# EAGLE design BusPirate-v4c-ll (EAGLE 5.11)
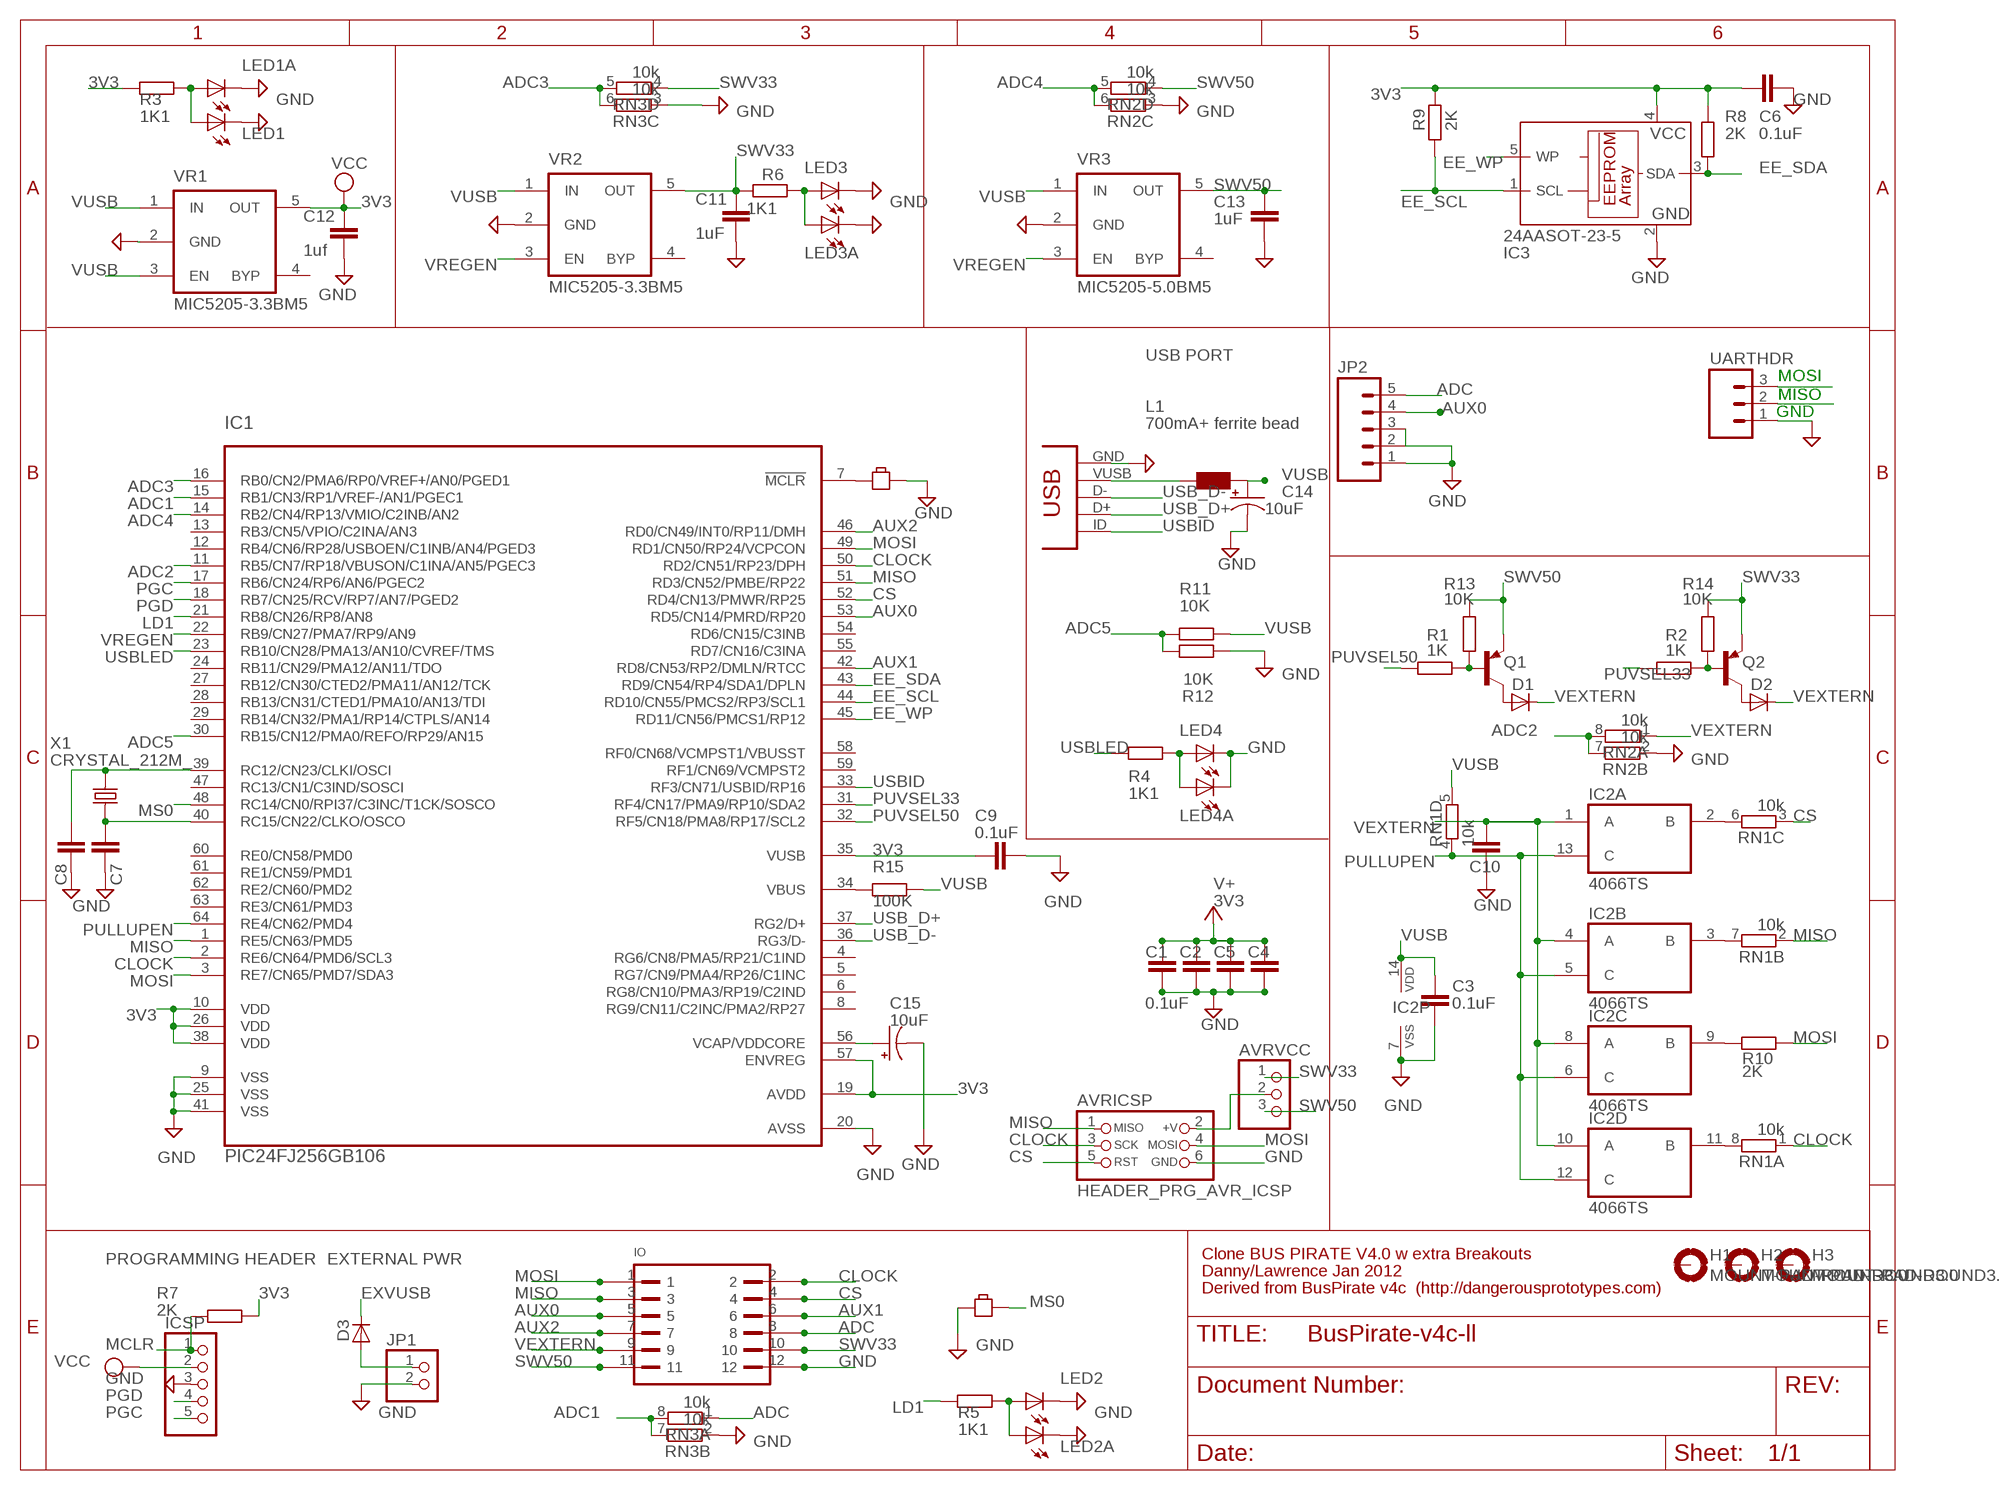
[diagram p0: schematic, sheet 1]

## Parts
AVRICSP  HEADER_PRG_AVR_ICSP  [HEADER_PRG_2X03]
AVRVCC  PINHD-1X3  [1X03]
C1  0.1uF  C-EUC0603  [C0603]
C2  0.1uF  C-EUC0603  [C0603]
C3  0.1uF  C-EUC0603  [C0603]
C4  0.1uF  C-EUC0603  [C0603]
C5  0.1uF  C-EUC0603  [C0603]
C6  0.1uF  C-EUC0603  [C0603]
C7  0.1uF  C-EUC0603  [C0603]
C8  0.1uF  C-EUC0603  [C0603]
C9  0.1uF  C-EUC0603  [C0603]
C10  0.1uF  C-EUC0603  [C0603]
C11  1uF  C-EUC0603  [C0603]
C12  1uf  C-EUC0603  [C0603]
C13  1uF  C-EUC0603  [C0603]
C14  10uF  CPOL-USA/3216-18R  [A/3216-18R]
C15  10uF  CPOL-USA/3216-18R  [A/3216-18R]
D1  MBR0520LT  [SOD123]
D2  MBR0520LT  [SOD123]
D3  MBR0520LT  [SOD123]
H1  MOUNT-PAD-ROUND3.0  [3,0-PAD]
H2  MOUNT-PAD-ROUND3.0  [3,0-PAD]
H3  MOUNT-PAD-ROUND3.0  [3,0-PAD]
IC1  PIC24FJ256GB106  [TQFP64-10X10]
IC2  4066TS  [40XX_TSSOP14]
IC3  24AASOT-23-5  24AA  [SOT-23-5]
ICSP  PINHD-1X5  [1X05]
IO  PINSHRD-PTH-2X06  [PINSHRD_PTH_2X06]
JP1  PINHD-1X02_2.54-S  [1X02-S]
JP2  M05PTH  [1X05]
L1  700mA+ ferrite bead  WE-KIL_0805  [WE-KI_0805_B]
LED1  LEDCHIP-LED0805  [CHIP-LED0805]
LED1A  LEDCHIP-LED0805  [CHIP-LED0805]
LED2  LEDCHIP-LED0805  [CHIP-LED0805]
LED2A  LEDCHIP-LED0805  [CHIP-LED0805]
LED3  LEDCHIP-LED0805  [CHIP-LED0805]
LED3A  LEDCHIP-LED0805  [CHIP-LED0805]
LED4  LEDCHIP-LED0805  [CHIP-LED0805]
LED4A  LEDCHIP-LED0805  [CHIP-LED0805]
NORMAL  BUTTON-SMD-2P  [BUTTON_2P_SMD]
Q1  MMBTA56-SOT23  [SOT23]
Q2  MMBTA56-SOT23  [SOT23]
R1  1K  R-EU_R0603  [R0603]
R2  1K  R-EU_R0603  [R0603]
R3  1K1  R-EU_R0603  [R0603]
R4  1K1  R-EU_R0603  [R0603]
R5  1K1  R-EU_R0603  [R0603]
R6  1K1  R-EU_R0603  [R0603]
R7  2K  R-EU_R0603  [R0603]
R8  2K  R-EU_R0603  [R0603]
R9  2K  R-EU_R0603  [R0603]
R10  2K  R-EU_R0603  [R0603]
R11  10K  R-EU_R0603  [R0603]
R12  10K  R-EU_R0603  [R0603]
R13  10K  R-EU_R0603  [R0603]
R14  10K  R-EU_R0603  [R0603]
R15  100K  R-EU_R0603  [R0603]
RESET  BUTTON-SMD-2P  [BUTTON_2P_SMD]
RN1  10k  RNETWORK  [RN8P-4R-CRA06S]
RN2  10k  RNETWORK  [RN8P-4R-CRA06S]
RN3  10k  RNETWORK  [RN8P-4R-CRA06S]
UARTHDR  M03LOCK  [1X03_LOCK]
USB  USB mini-b  CON-USB-MINI-BUSB1  [CONN_USB_MINI-B]
VR1  MIC5205-3.3BM5  MIC5205  [SOT-23-5]
VR2  MIC5205-3.3BM5  MIC5205  [SOT-23-5]
VR3  MIC5205-5.0BM5  MIC5205  [SOT-23-5]
X1  CRYSTAL_212M_  [4X6]

## Nets
3V3: C1.1 C2.1 C4.1 C5.1 C6.1 C9.1 C12.1 IC1.10(VDD) IC1.19(AVDD) IC1.26(VDD) IC1.35(VUSB) IC1.38(VDD) IC1.57(ENVREG) IC3.4(VCC) ICSP.2 R3.2 R7.2 R8.2 R9.2 VR1.5(OUT) ; supply symbol labelled VCC, V+
ADC: IO.8 JP2.5 RN3.1
ADC1: IC1.15(RB1/CN3/RP1/VREF-/AN1/PGEC1) RN3.7 RN3.8
ADC2: IC1.11(RB5/CN7/RP18/VBUSON/C1INA/AN5/PGEC3) RN2.7 RN2.8
ADC3: IC1.16(RB0/CN2/PMA6/RP0/VREF+/AN0/PGED1) RN3.5 RN3.6
ADC4: IC1.14(RB2/CN4/RP13/VMIO/C2INB/AN2) RN2.5 RN2.6
ADC5: IC1.30(RB15/CN12/PMA0/REFO/RP29/AN15) R11.2 R12.2
AUX0: IC1.53(RD5/CN14/PMRD/RP20) IO.5 JP2.4
AUX1: IC1.42(RD8/CN53/RP2/DMLN/RTCC) IO.6
AUX2: IC1.46(RD0/CN49/INT0/RP11/DMH) IO.7
CLOCK: AVRICSP.3(SCK) IC1.2(RE6/CN64/PMD6/SCL3) IC1.50(RD2/CN51/RP23/DPH) IO.2 RN1.1
CS: AVRICSP.5(RST) IC1.52(RD4/CN13/PMWR/RP25) IO.4 RN1.3
EE_SCL: IC1.44(RD10/CN55/PMCS2/RP3/SCL1) IC3.1(SCL) R9.1
EE_SDA: IC1.43(RD9/CN54/RP4/SDA1/DPLN) IC3.3(SDA) R8.1
EE_WP: IC1.45(RD11/CN56/PMCS1/RP12) IC3.5(WP)
EXVUSB: D3.C L1.2 USB.VUSB
GND: AVRICSP.6(GND) C1.2 C2.2 C3.2 C4.2 C5.2 C6.2 C7.2 C8.2 C9.2 C10.2 C11.2 C12.2 C13.2 C14.- C15.- IC1.9(VSS) IC1.20(AVSS) IC1.25(VSS) IC1.41(VSS) IC2.7(P:VSS) IC3.2(GND) ICSP.3 IO.12 JP1.2 JP2.1 JP2.2 JP2.3 LED1.C LED1A.C LED2.C LED2A.C LED3.C LED3A.C LED4.C LED4A.C NORMAL.1 R12.1 RESET.P$2 RN2.2 RN2.3 RN3.2 RN3.3 UARTHDR.1 USB.GND VR1.2(GND) VR2.2(GND) VR3.2(GND)
LD1: IC1.21(RB8/CN26/RP8/AN8) R5.2
MCLR: IC1.7(!MCLR) ICSP.1 R7.1 RESET.1
MISO: AVRICSP.1(MISO) IC1.1(RE5/CN63/PMD5) IC1.51(RD3/CN52/PMBE/RP22) IO.3 RN1.2 UARTHDR.2
MOSI: AVRICSP.4(MOSI) IC1.3(RE7/CN65/PMD7/SDA3) IC1.49(RD1/CN50/RP24/VCPCON) IO.1 R10.1 UARTHDR.3
MS0: IC1.48(RC14/CN0/RPI37/C3INC/T1CK/SOSCO) NORMAL.P$2
N$1: IC2.9(C:B) R10.2
N$2: IC2.11(D:B) RN1.8
N$3: D1.A Q1.3(C)
N$4: IC2.2(A:B) RN1.6
N$5: IC2.3(B:B) RN1.7
N$6: LED2.A LED2A.A R5.1
N$7: LED1.A LED1A.A R3.1
N$8: Q2.1(B) R2.1 R14.2
N$9: C7.1 IC1.40(RC15/CN22/CLKO/OSCO) X1.2(X2)
N$10: C15.+ IC1.56(VCAP/VDDCORE)
N$11: IC1.34(VBUS) R15.2
N$12: C8.1 IC1.39(RC12/CN23/CLKI/OSCI) X1.1(X1)
N$13: LED4.A LED4A.A R4.1
N$14: D2.A Q2.3(C)
N$15: D3.A JP1.1
N$16: AVRICSP.2(+V) AVRVCC.2
N$17: Q1.1(B) R1.1 R13.2
N$18: LED3.A LED3A.A R6.1
PGC: IC1.17(RB6/CN24/RP6/AN6/PGEC2) ICSP.5
PGD: IC1.18(RB7/CN25/RCV/RP7/AN7/PGED2) ICSP.4
PULLUPEN: IC1.64(RE4/CN62/PMD4) IC2.5(B:C) IC2.6(C:C) IC2.12(D:C) IC2.13(A:C) RN1.4
PUVSEL33: IC1.31(RF4/CN17/PMA9/RP10/SDA2) R2.2
PUVSEL50: IC1.32(RF5/CN18/PMA8/RP17/SCL2) R1.2
SWV33: AVRVCC.1 C11.1 IO.10 Q2.2(E) R6.2 R14.1 RN3.4 VR2.5(OUT)
SWV50: AVRVCC.3 C13.1 IO.11 Q1.2(E) R13.1 RN2.4 VR3.5(OUT)
USB_D+: IC1.37(RG2/D+) USB.D+
USB_D-: IC1.36(RG3/D-) USB.D-
USBID: IC1.33(RF3/CN71/USBID/RP16) USB.ID(USBID)
USBLED: IC1.23(RB10/CN28/PMA13/AN10/CVREF/TMS) R4.2
VEXTERN: C10.1 D1.C D2.C IC2.1(A:A) IC2.4(B:A) IC2.8(C:A) IC2.10(D:A) IO.9 RN2.1
VREGEN: IC1.22(RB9/CN27/PMA7/RP9/AN9) VR2.3(EN) VR3.3(EN)
VUSB: C3.1 C14.+ IC2.14(P:VDD) L1.1 R11.1 R15.1 RN1.5 VR1.1(IN) VR1.3(EN) VR2.1(IN) VR3.1(IN)
Unconnected: H1.B3,0(MOUNT) H2.B3,0(MOUNT) H3.B3,0(MOUNT) IC1.4(RG6/CN8/PMA5/RP21/C1IND) IC1.5(RG7/CN9/PMA4/RP26/C1INC) IC1.6(RG8/CN10/PMA3/RP19/C2IND) IC1.8(RG9/CN11/C2INC/PMA2/RP27) IC1.12(RB4/CN6/RP28/USBOEN/C1INB/AN4/PGED3) IC1.13(RB3/CN5/VPIO/C2INA/AN3) IC1.24(RB11/CN29/PMA12/AN11/TDO) IC1.27(RB12/CN30/CTED2/PMA11/AN12/TCK) IC1.28(RB13/CN31/CTED1/PMA10/AN13/TDI) IC1.29(RB14/CN32/PMA1/RP14/CTPLS/AN14) IC1.47(RC13/CN1/C3IND/SOSCI) IC1.54(RD6/CN15/C3INB) IC1.55(RD7/CN16/C3INA) IC1.58(RF0/CN68/VCMPST1/VBUSST) IC1.59(RF1/CN69/VCMPST2) IC1.60(RE0/CN58/PMD0) IC1.61(RE1/CN59/PMD1) IC1.62(RE2/CN60/PMD2) IC1.63(RE3/CN61/PMD3) USB.BODY@1(BODY) USB.BODY@2(BODY) USB.BODY@3(BODY) USB.BODY@4(BODY) VR1.4(BYP) VR2.4(BYP) VR3.4(BYP)

## Notes on the sheet
- USB PORT
- MOSI
- MISO
- GND
- Clone BUS PIRATE V4.0 w extra Breakouts
- PROGRAMMING HEADER | EXTERNAL PWR
- Danny/Lawrence Jan 2012
- Derived from BusPirate v4c  (http://dangerousprototypes.com)

## Library data of the parts
AVRICSP = dp_devices:HEADER_PRG_AVR_ICSP: 2x3 AVR ICSP programming header
AVRVCC = adafruit:PINHD-1X3: PIN HEADER
C1-C13 = rcl:C-EU: CAPACITOR, European symbol
C14 C15 = LL:CPOL-US: POLARIZED CAPACITOR, American symbol Footprints somewhat modified from Adafruits (1206)
D1-D3 = diode:MBR0520LT: SCHOTTKY BARRIER RECTIFIER Source: http://onsemi.com .. MBR0520LT1-D.pdf
H1-H3 = holes:MOUNT-PAD-ROUND: MOUNTING PAD, round
IC1 = LL:PIC24FJ256GB106: 16-Bit Flash Microcontroller with USB On-The-Go(OTG)
IC2 = 40xx:4066: Quad bilateral ANALOG SWITCH
IC3 = dp_devices:24AA*; 24AA: 24AA
ICSP = pinhead:PINHD-1X5: PIN HEADER
IO = dp_devices:PINSHRD-PTH-2X06: Shrouded pin header, 2.54mm pitch
JP1 = pinhead-2:PINHD-1X02: PIN HEADER
JP2 = SparkFun - Copy:M05: Header 5 Standard 5-pin 0.1" header. Use with straight break away headers (SKU : PRT-00116), right angle break away headers (PRT-00553), swiss pins (PRT-00743), machine pins (PRT-00117), and female headers (PRT-00115). Molex polarized connector foot print use with SKU : PRT-08230 with associated crimp pins and housings.
L1 = wuerth-elektronik:WE-KIL: SMD Wire Wound Ceramic Inductor WE-KIL - Low profile - High Q values -- Bluetooth -- Wireless LAN -- RF oscillation circuit -- IF impedance matching
LED1 LED1A LED2 LED2A LED3 LED3A LED4 LED4A = led:LED: LED OSRAM: - CHIPLED LG R971, LG N971, LY N971, LG Q971, LY Q971, LO R971, LY R971 LH N974, LH R974 LS Q976, LO Q976, LY Q976 LO Q996 - Hyper CHIPLED LW Q18S LB Q993, LB Q99A, LB R99A - SideLED LS A670, LO A670, LY A670, LG A670, LP A670 LB A673, LV A673, LT A673, LW A673 LH A674 LY A675 LS A676, LA A676, LO A676, LY A676, LW A676 LS A679, LY A679, LG A679 - Hyper Micro SIDELED® LS Y876, LA Y876, LO Y876, LY Y876 LT Y87S - SmartLED LW L88C, LW L88S LB L89C, LB L89S, LG L890 LS L89K, LO L89K, LY L89K LS L896, LA L896, LO L896, LY L896 - TOPLED LS T670, LO T670, LY T670, LG T670, LP T670 LSG T670, LSP T670, LSY T670, LOP T670, LYG T670 LG T671, LOG T671, LSG T671 LB T673, LV T673, LT T673, LW T673 LH T674 LS T676, LA T676, LO T676, LY T676, LB T676, LH T676, LSB T676, LW T676 LB T67C, LV T67C, LT T67C, LS T67K, LO T67K, LY T67K, LW E67C LS E67B, LA E67B, LO E67B, LY E67B, LB E67C, LV E67C, LT E67C LW T67C LS T679, LY T679, LG T679 LS T770, LO T770, LY T770, LG T770, LP T770 LB T773, LV T773, LT T773, LW T773 LH T774 LS E675, LA E675, LY E675, LS T675 LS T776, LA T776, LO T776, LY T776, LB T776 LHGB T686 LT T68C, LB T68C - Hyper Mini TOPLED® LB M676 - Mini TOPLED Santana® LG M470 LS M47K, LO M47K, LY M47K Source: http://www.osram.convergy.de LUXEON: - LUMILED® LXK2-PW12-R00, LXK2-PW12-S00, LXK2-PW14-U00, LXK2-PW14-V00 LXK2-PM12-R00, LXK2-PM12-S00, LXK2-PM14-U00 LXK2-PE12-Q00, LXK2-PE12-R00, LXK2-PE12-S00, LXK2-PE14-T00, LXK2-PE14-U00 LXK2-PB12-K00, LXK2-PB12-L00, LXK2-PB12-M00, LXK2-PB14-N00, LXK2-PB14-P00, LXK2-PB14-Q00 LXK2-PR12-L00, LXK2-PR12-M00, LXK2-PR14-Q00, LXK2-PR14-R00 LXK2-PD12-Q00, LXK2-PD12-R00, LXK2-PD12-S00 LXK2-PH12-R00, LXK2-PH12-S00 LXK2-PL12-P00, LXK2-PL12-Q00, LXK2-PL12-R00 Source: www.luxeon.com KINGBRIGHT: KA-3528ASYC Source: www.kingbright.com
NORMAL RESET = Itead_BP_110825.lbr:BUTTON-SMD-2P: BAS014
Q1 Q2 = transistor-pnp:*-?: PNP Transistor
R1-R3 R5-R10 R13-R15 = rcl:R-EU_: RESISTOR, European symbol
R4 R11 R12 = resistor:R-EU_: RESISTOR, European symbol
RN1-RN3 = dp_devices:RNETWORK: 4 Resistor Array 0603
UARTHDR = SparkFun - Copy:M03: Header 3 Standard 3-pin 0.1" header. Use with straight break away headers (SKU : PRT-00116), right angle break away headers (PRT-00553), swiss pins (PRT-00743), machine pins (PRT-00117), and female headers (PRT-00115). Molex polarized connector foot print use with SKU : PRT-08232 with associated crimp pins and housings.
USB = dp_devices:CON-USB-MINI-B: USB connector
VR1-VR3 = dp_devices:MIC5205: 150ma Low-Noise LDO Regulator
X1 = dp_devices:CRYSTAL_2

## Board
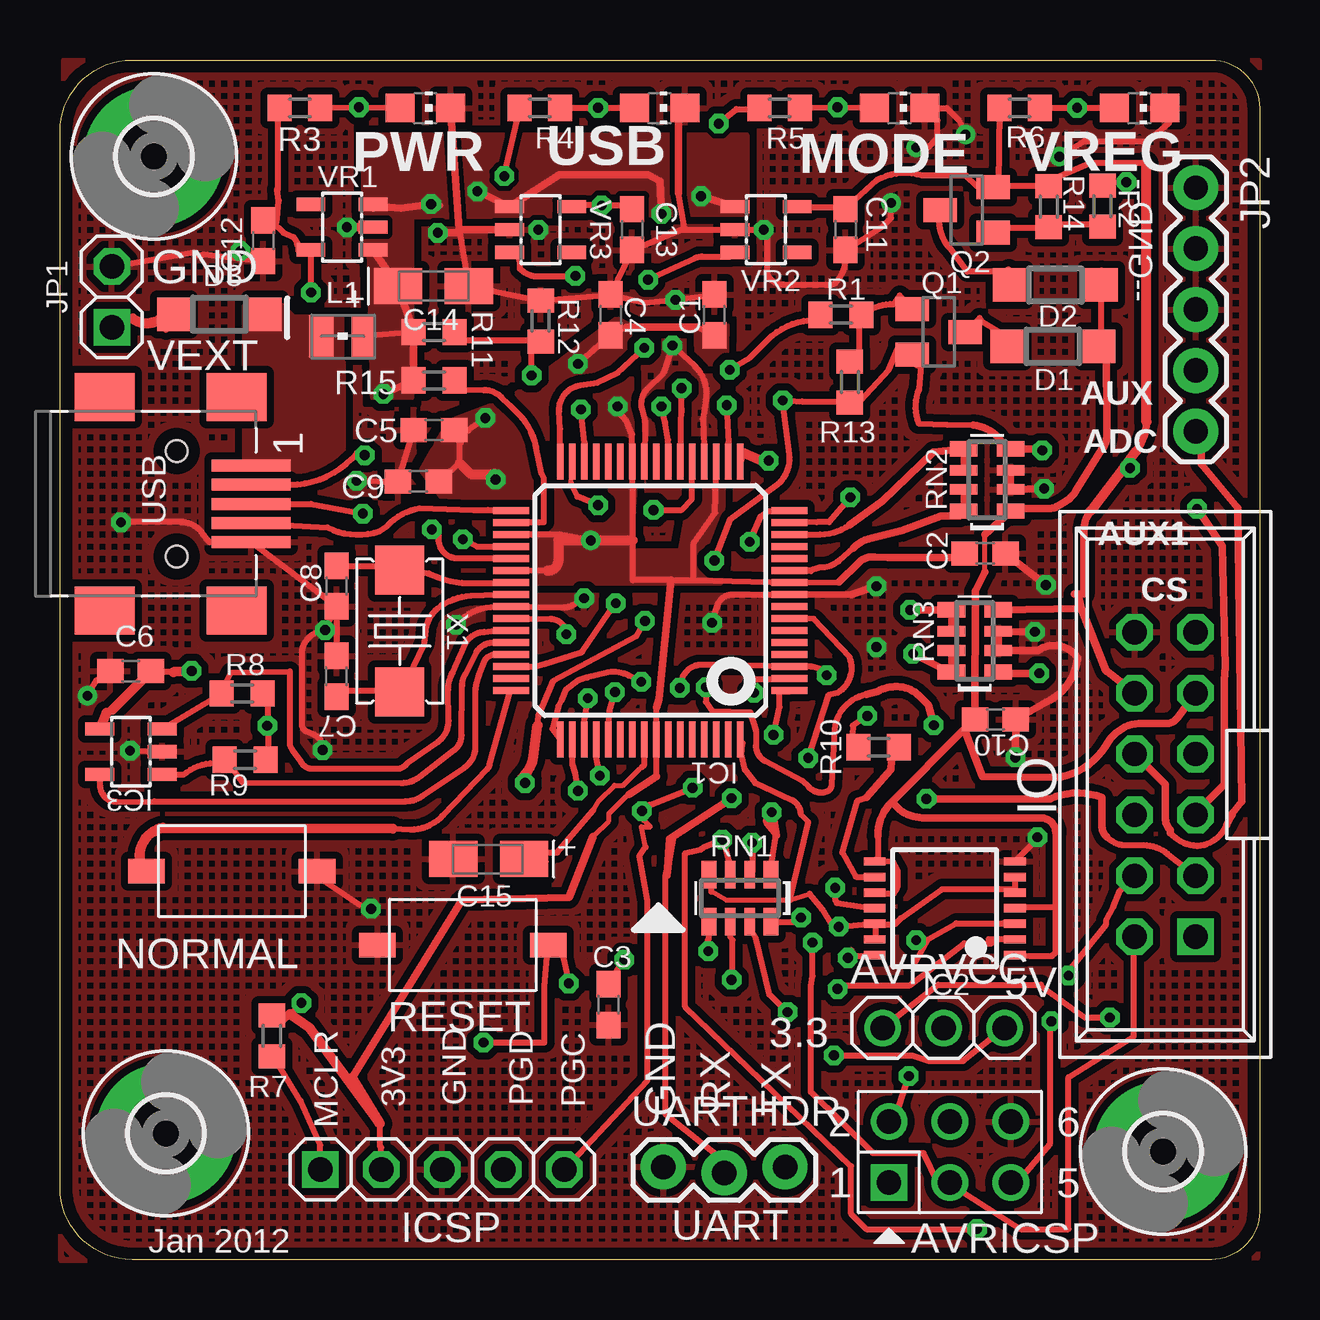
[diagram p1: board, top side]
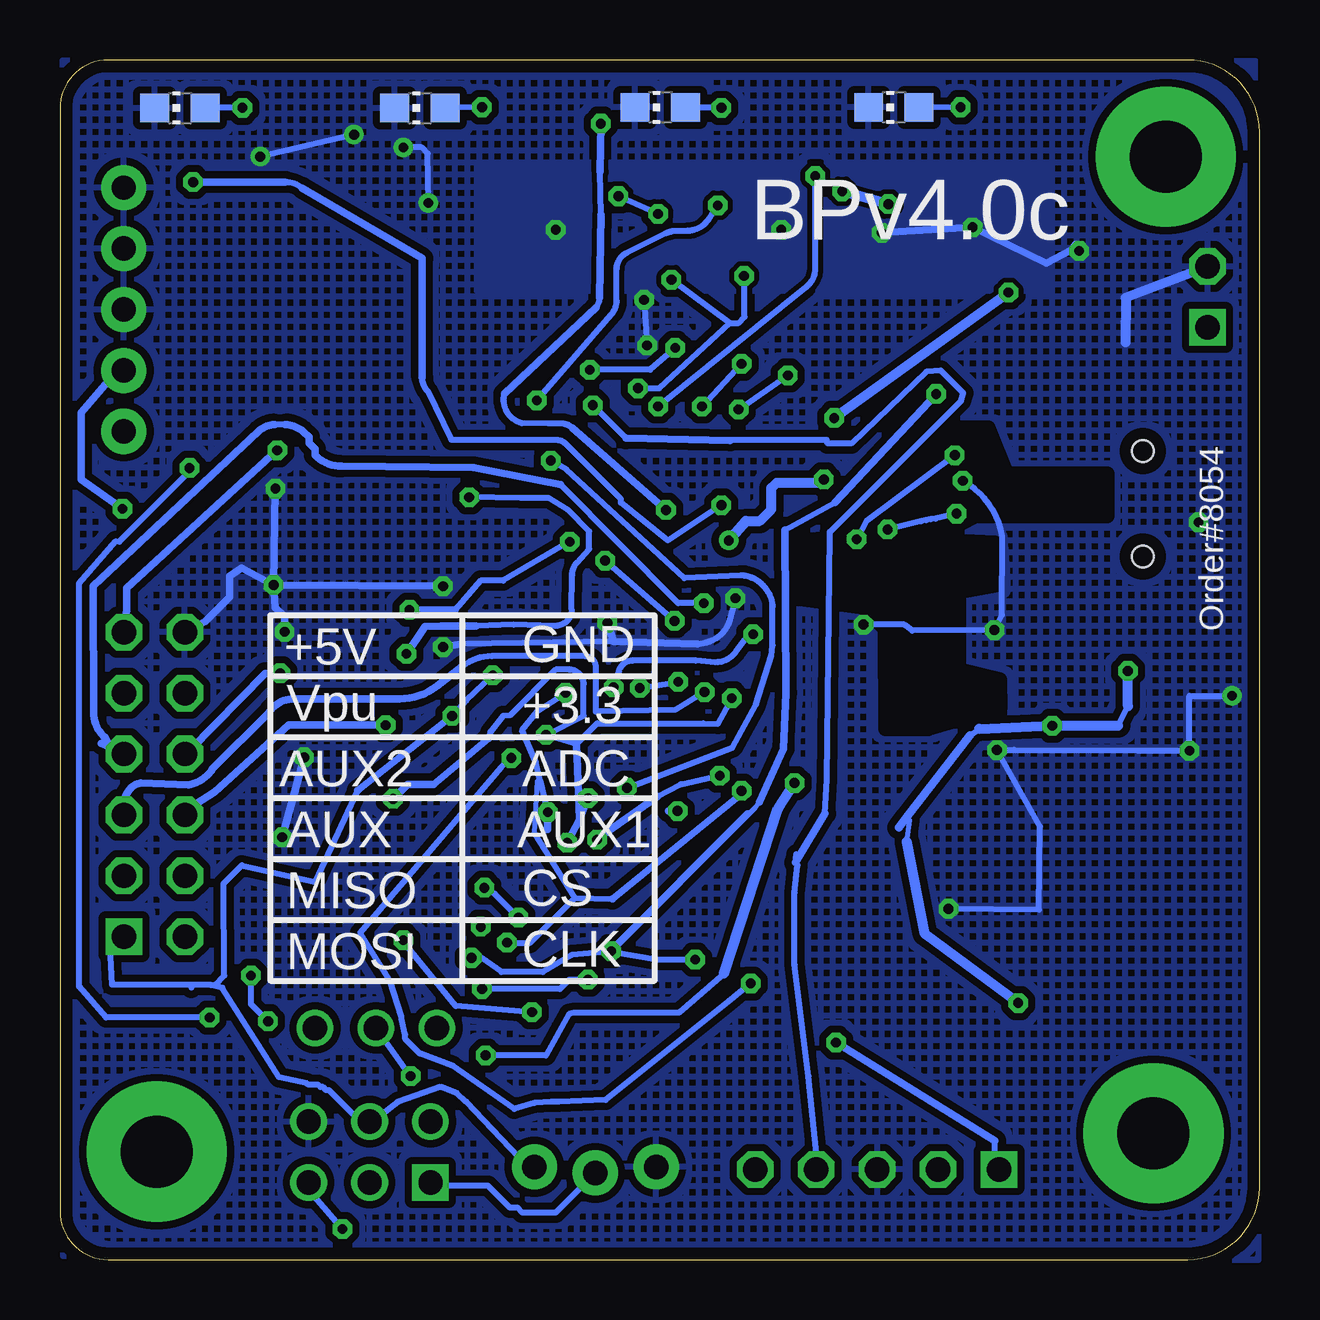
[diagram p2: board, bottom side, seen from below]

Size 50 x 50 mm. Coordinates in mm from the lower left corner, seen from the top.
Outline: 3,50 48,50 arc-90 50,48 50,2 arc-90 48,0 3,0 arc-90 0,3 0,47 arc-90 3,50
Copper layers (1*16): Top 0.0356mm / dielectric 1.5011mm / Bottom 0.0356mm
Design rules "LaenPCBOrder-LL-strict": minimum track width 8mil, minimum drill 16mil, track to track 8mil, track to pad 8mil, pad to pad 12mil, via to via 10mil, smd to smd 4mil, copper to edge 20mil, drill to drill 15mil, minimum pad ring 8mil, minimum via ring 8mil, stop-mask expansion 6mil, vias tented up to drill 25mil, thermal gap 12mil
tKeepout: area 1,43 to 7,49; area 53,43 to 59,49; area 53,14 to 59,20; area 1,14 to 7,20
bKeepout: area -0.2,41.8 to 8.2,50.2; area 51.8,41.8 to 60.2,50.2; area 51.8,12.8 to 60.2,21.2; area -0.2,12.8 to 8.2,21.2
bRestrict: area 10.8,22.1 to 19.3,30.1; area 6.3,28.8 to 19.4,34.7

### Footprints (pad centres in the part's own frame; a part is rotated, then mirrored left to right if it is on the bottom)
HEADER_PRG_2X03 = drill 1.016 square: 1 -2.54,-1.27 | drill 1.016 round: 2 -2.54,1.27; 3 0,-1.27; 4 0,1.27; 5 2.54,-1.27; 6 2.54,1.27
1X03 = drill 1.016 round: 1 -2.54,0; 2 0,0; 3 2.54,0
C0603 = smd 1.1 x 1: 1 -0.85,0; 2 0.85,0
A/3216-18R = smd 2.007 x 1.5: + 1.502,0 | smd 2.025 x 1.5: - -1.451,0
SOD123 = smd 1.4 x 1.4: A 1.9,0; C -1.9,0
3,0-PAD = drill 3 pad 5.842 round: B3,0 0,0
TQFP64-10X10 = smd 1.5 x 0.28: 1 -5.8,3.75; 2 -5.8,3.25; 3 -5.8,2.75; 4 -5.8,2.25; 5 -5.8,1.75; 6 -5.8,1.25; 7 -5.8,0.75; 8 -5.8,0.25; 9 -5.8,-0.25; 10 -5.8,-0.75; 11 -5.8,-1.25; 12 -5.8,-1.75; 13 -5.8,-2.25; 14 -5.8,-2.75; 15 -5.8,-3.25; 16 -5.8,-3.75; 33 5.8,-3.75; 34 5.8,-3.25; 35 5.8,-2.75; 36 5.8,-2.25; 37 5.8,-1.75; 38 5.8,-1.25; 39 5.8,-0.75; 40 5.8,-0.25; 41 5.8,0.25; 42 5.8,0.75; 43 5.8,1.25; 44 5.8,1.75; 45 5.8,2.25; 46 5.8,2.75; 47 5.8,3.25; 48 5.8,3.75 | smd 0.28 x 1.5: 17 -3.75,-5.8; 18 -3.25,-5.8; 19 -2.75,-5.8; 20 -2.25,-5.8; 21 -1.75,-5.8; 22 -1.25,-5.8; 23 -0.75,-5.8; 24 -0.25,-5.8; 25 0.25,-5.8; 26 0.75,-5.8; 27 1.25,-5.8; 28 1.75,-5.8; 29 2.25,-5.8; 30 2.75,-5.8; 31 3.25,-5.8; 32 3.75,-5.8; 49 3.75,5.8; 50 3.25,5.8; 51 2.75,5.8; 52 2.25,5.8; 53 1.75,5.8; 54 1.25,5.8; 55 0.75,5.8; 56 0.25,5.8; 57 -0.25,5.8; 58 -0.75,5.8; 59 -1.25,5.8; 60 -1.75,5.8; 61 -2.25,5.8; 62 -2.75,5.8; 63 -3.25,5.8; 64 -3.75,5.8
40XX_TSSOP14 = smd 0.35 x 0.9: 1 -1.95,-2.925; 2 -1.3,-2.925; 3 -0.65,-2.925; 4 0,-2.925; 5 0.65,-2.925; 6 1.3,-2.925; 7 1.95,-2.925; 8 1.95,2.925; 9 1.3,2.925; 10 0.65,2.925; 11 0,2.925; 12 -0.65,2.925; 13 -1.3,2.925; 14 -1.95,2.925
SOT-23-5 = smd 0.55 x 1.2: 1 -0.95,-1.3; 2 0,-1.3; 3 0.95,-1.3; 4 0.95,1.3; 5 -0.95,1.3
1X05 = drill 1.016 square: 1 -5.08,0 | drill 1.016 octagon: 2 -2.54,0; 3 0,0; 4 2.54,0; 5 5.08,0
PINSHRD_PTH_2X06 = drill 1.016 square: 1 -6.35,-1.27 | drill 1.016 octagon: 2 -6.35,1.27; 3 -3.81,-1.27; 4 -3.81,1.27; 5 -1.27,-1.27; 6 -1.27,1.27; 7 1.27,-1.27; 8 1.27,1.27; 9 3.81,-1.27; 10 3.81,1.27; 11 6.35,-1.27; 12 6.35,1.27
1X02-S = drill 1.016 square: 1 -1.27,0 | drill 1.016 octagon: 2 1.27,0
1X05' = drill 1.016 pad 1.88 round: 1 0,0; 2 2.54,0; 3 5.08,0; 4 7.62,0; 5 10.16,0
WE-KI_0805_B = smd 1.02 x 1.78: 1 -0.89,0; 2 0.89,0
CHIP-LED0805 = smd 1.2 x 1.2: A 0,-1.05; C 0,1.05
BUTTON_2P_SMD = smd 1.524 x 1.016: 1 -3.556,0; P$2 3.556,0
SOT23 = smd 1 x 1.4: 1 -0.95,-1.1; 2 0.95,-1.1; 3 0,1.1
R0603 = smd 1 x 1.1: 1 -0.85,0; 2 0.85,0
RN8P-4R-CRA06S = smd 0.63 x 1.15: 1 -1.295,-0.975; 4 1.295,-0.975; 5 1.295,0.975; 8 -1.295,0.975 | smd 0.44 x 1.15: 2 -0.4,-0.975; 3 0.4,-0.975; 6 0.4,0.975; 7 -0.4,0.975
1X03_LOCK = drill 1.016 pad 1.88 round: 1 0,0.127; 2 2.54,-0.127; 3 5.08,0.127
CONN_USB_MINI-B = smd 2 x 2.5: BODY@1 -4.45,2.5; BODY@2 4.45,2.5; BODY@3 4.45,-3; BODY@4 -4.45,-3 | smd 0.5 x 3.3: D+ 0,3.1; D- -0.8,3.1; GND 1.6,3.1; ID 0.8,3.1; VUSB -1.6,3.1 | hole 0.9: -2.2,0; 2.2,0
4X6@1 = smd 2.032 x 2.032: 1 -2.54,0; 2 2.54,0

### Placement (x,y rotation side)
AVRICSP  37.09,4.48 0 top
AVRVCC  36.83,9.65 0 top
C1  27.27,39.37 90 top
C2  38.56,29.44 0 top
C3  22.86,10.62 270 top
C4  22.96,39.37 90 top
C5  15.59,34.58 180 top
C6  2.95,24.53 180 top
C7  11.53,24.31 90 top
C8  11.53,28.07 270 top
C9  14.94,32.44 180 top
C10  38.99,22.51 0 top
C11  32.73,42.93 270 top
C12  8.47,42.46 270 top
C13  23.84,42.93 270 top
C14  15.59,40.57 180 top
C15  17.84,16.69 0 top
D1  41.39,38.06 180 top
D2  41.49,40.62 180 top
D3  6.65,39.4 180 top
H1  3.91,45.97 0 top
H2  4.42,5.26 0 top
H3  45.97,4.5 0 top
IC1  24.61,27.47 180 top
IC2  36.88,14.64 90 top
IC3  2.96,21.17 90 top
ICSP  15.94,3.75 0 top
IO  46.07,19.8 90 top
JP1  2.16,40.12 90 top
JP2  [1X05']  47.35,44.68 270 top
L1  11.78,38.48 180 top
LED1  15.23,48 270 top
LED1A  15.24,48.02 90 bottom
LED2  35,48 270 top
LED2A  35,48 90 bottom
LED3  45,48 270 top
LED3A  45,48 90 bottom
LED4  25,48 270 top
LED4A  24.98,48.02 90 bottom
NORMAL  7.16,16.19 180 top
Q1  36.62,38.66 270 top
Q2  37.79,43.74 90 top
R1  32.55,39.38 180 top
R2  43.45,43.9 90 top
R3  10,48 180 top
R4  20,48 180 top
R5  30,48 180 top
R6  40,48 180 top
R7  8.84,9.33 90 top
R8  7.59,23.59 0 top
R9  7.72,20.83 0 top
R10  34.12,21.36 0 top
R11  15.59,38.66 0 top
R12  20.04,39.12 270 top
R13  32.92,36.57 90 top
R14  41.21,43.89 270 top
R15  15.59,36.64 0 top
RESET  16.79,13.11 180 top
RN1  28.34,15.06 180 top
RN2  38.64,32.5 90 top
RN3  38.13,25.79 90 top
UARTHDR  25.15,3.73 0 top
USB  4.87,31.5 270 top
VR1  11.75,43.03 90 top
VR2  29.43,42.93 270 top
VR3  20.04,42.93 270 top
X1  CRYSTAL_212M_  [4X6@1]  14.16,26.2 270 top

### Tracks (layer width: path | path; a pad name or v marks a point on that pad's centre or on a via)
3V3  (via drill 0.41)
  Top 0.203: 22.23,17.63 22.89,18.29 22.89,18.59 23.6,19.3 23.72,19.38
  Top 0.254: 9.14,47.95 R3.2 9.09,47.9 9.09,44.6 9.04,44.6 9.12,44.15 9.04,43.36 9.02,43.23 C12.1 9.12,43 9.32,42.8 9.72,42.62 arc-45 9.96,42.01 10.46,42.01 VR1.5 10.46,41.91 v10.46,40.31 | 26.42,28.32 25.48,28.32 23.88,28.32 23.88,29.97 23.88,31.24 IC1.26 23.85,34.39 23.71,34.71 arc41 23.28,35.27 v23.24,35.56 | 26.42,28.32 26.42,29.84 27.3,31.11 IC1.19 | 26.42,28.32 IC1.10 32.46,28.25 | 8.69,22.5 8.69,20.88 8.79,20.88 R9.2 | 8.69,22.5 8.69,23.57 R8.2 | 2.18,22.91 1.93,22.78 | 3.76,24.49 C6.1 3.86,24.49 4.72,24.49 | v8.64,22.25 8.69,22.5 | C9.1 15.54,32.21 16.66,33.2 16.66,34.19 16.46,34.19 C5.1 | 24.87,23.01 24.87,21.69 IC1.57 24.86,21.17 24.87,21.16 24.87,20.14 | 19.63,30.23 18.82,30.23 IC1.35 | 19.63,30.23 19.74,30.22 | C5.1 16.71,34.04 | v17.73,35.08 16.46,34.24 C5.1 | v21.59,37.34 C4.1 23.62,38.86 | 26.54,38.86 C1.1 | 19.63,30.23 20.83,30.23 v22.12,29.97 | C5.1 17.02,34.54 | IC1.38 20.32,28.7 | 13.34,5.66 13.34,4.72 13.39,4.67 ICSP.2 | 8.84,10.16 R7.2 9.25,9.88 9.59,10.22 v10.06,10.69
  Top 0.305: 32.46,28.25 33.27,29.03 arc-48 33.95,29.29 34.52,29.26 37.54,29.26 37.69,29.41 C2.1 | 24.87,23.01 24.97,23.37 25.48,28.32 | 23.62,38.86 26.54,38.86 | 23.72,19.38 24.87,20.14 | 22.23,17.63 21.21,15.09 16.76,14.99 12.18,7.58
  Top 0.406: 3.76,24.49 2.18,22.91 | 1.93,22.78 IC3.4 | v5.49,24.54 4.72,24.49 | 18.13,32.74 17.12,32.74 16.66,33.2 | 23.88,29.97 v22.12,29.97 20.78,29.97 20.78,29.16 arc-90 20.32,28.7 | 12.18,7.58 13.34,5.66 10.41,9.65 9.59,10.22
  Bottom 0.203: 14.71,17.42 14.58,18.31 14.72,18.42
  Bottom 0.254: 5.89,22.25 5.49,23.06 | 12.06,21.84 11.68,22.12 | v23.24,35.56 v21.59,37.34
  Bottom 0.356: 12.06,21.84 14.72,18.42 15.04,18.01
  Bottom 0.406: 5.89,22.25 v8.64,22.25 11.68,22.12 | 5.49,23.06 v5.49,24.54 | v17.73,35.08 v10.46,40.31 | v22.12,29.97 21.41,30.79 20.83,30.79 20.34,31.27 20.34,32.16 20.12,32.38 18.29,32.38 v18.16,32.51 | v10.06,10.69 13.95,13.56 14.71,17.42
  pour Top (isolate 0.305, no thermals): 18.8,35.91 23.21,39.22 23.7,38.96 23.97,32.64 23.78,29.53 25.88,29.53 26.64,33.75 26.54,38.67 27.78,38.93 27.53,28.2 18.64,28.2 15.08,32.9 16.23,34.93
ADC  (via drill 0.41)
  Top 0.254: 48.62,18.12 arc-64 47.43,17.25 47.38,17.25 arc-45 46.28,17.77
  Top 0.305: v40.82,24.43 39.17,24.43 RN3.1 | 48.62,18.12 48.78,18.42 48.87,18.54 48.87,18.59 49.25,19.1 49.1,31.32 47.57,33.15 47.57,34.29 JP2.5 | 46.28,17.77 46.28,17.9 arc-45 46.08,18.4 46.08,19.8 IO.8
  Bottom 0.305: v40.82,24.43 41.45,24.43 44.6,21.21 IO.8
ADC1  (via drill 0.41)
  Top 0.254: v32.94,31.77 32.05,30.73 31.55,30.73 IC1.15
  Top 0.305: RN3.7 37.19,25.35 37.19,24.54 RN3.8 37.08,24.49 v35.56,25.25
  Bottom 0.254: 32.66,26.42 31.09,26.47 29.38,26.41 arc-92 28.67,27.09 28.65,28.52 arc41 28.44,29.06 27.94,29.62 27.94,30.35 28.83,31.24 29.64,31.75 30.81,31.75 v32.94,31.77
  Bottom 0.305: v35.56,25.25 34.77,26.39 34.11,26.42 32.66,26.42
ADC2
  Top 0.203: 31.22,28.73 31.32,28.68 IC1.11
  Top 0.254: 31.22,28.73 31.68,28.85 arc42 32.48,29.14 33.06,29.66
  Top 0.305: RN2.7 37.69,32.05 37.69,31.24 RN2.8 37.64,31.14 37.49,30.99 36.73,30.99 35.1,30.38 33.84,30.08 arc29 33.06,29.66
ADC3  (via drill 0.41)
  Top 0.254: v28.75,29.92 29.21,30.99 29.52,31.19 30.4,31.19 IC1.16
  Top 0.305: RN3.6 37.19,26.21 37.19,27.08 RN3.5 37.08,27.08 v35.43,27.08
  Bottom 0.254: 33.53,27.08 32.46,28.3 31.52,28.3 v28.75,29.92
  Bottom 0.305: 33.53,27.08 v35.43,27.08
ADC4
  Top 0.254: 32.91,30.62 arc-36 31.69,30.23 30.3,30.23 IC1.14
  Top 0.305: RN2.6 37.69,32.92 37.69,33.78 RN2.5 37.59,33.78 36.4,33.66 34.29,31.62 32.91,30.62
ADC5  (via drill 0.41)
  Top 0.254: R11.2 16.46,38.3 20.02,38.3 R12.2 19.66,38.25 v19.66,36.85 | v21.72,35.43 21.82,35.28 21.74,35.15 21.87,34.04 IC1.30
  Bottom 0.254: v21.72,35.43 v19.66,36.85
AUX0  (via drill 0.41)
  Top 0.254: v23.13,23.66 22.91,22.86 22.89,22.61 22.89,21.69 IC1.53
  Top 0.305: v47.4,31.29 48.44,29.74 48.56,24.69 48.54,24.16 48.54,19.81 47.35,18.62 47.35,18.54 IO.5
  Bottom 0.254: v23.13,23.66 24.35,22.91 27.66,22.84 27.66,24.7 arc-90 28.11,25.15 32,25.15 arc-38 33.23,24.72
  Bottom 0.305: 33.23,24.72 34.29,23.9 arc38 35.84,23.37 40.26,23.37 arc-60 41.32,22.75 43.64,20.48 arc48 44.55,19.8 44.63,19.79 46.63,19.86 arc-58 47.23,19.38 47.3,19.23 IO.5 | JP2.4 47.62,37.06 49.12,35.31 49.12,32.51 v47.4,31.29
AUX1  (via drill 0.41)
  Top 0.254: v26.92,23.85 26.92,23.24 27.18,22.86 28.77,22.82 29.01,22.04 29.01,21.42 arc62 29.4,20.77 30.94,19.96 31.21,19.69 arc56 31.89,19.48 arc76 32.17,19.8 32.3,22.1 arc-74 33.61,23.56 | IC1.42 20.45,26.7 arc-88 v21.11,26.06
  Top 0.305: 33.61,23.56 33.76,23.6 34.09,23.68 arc-31 34.8,23.88 34.91,23.88 arc-45 35.8,23.51 36.2,23.11 v36.42,22.28
  Bottom 0.254: v21.11,26.06 21.49,25.81 21.84,25.32 arc54 22.68,24.89 23.5,24.97 26.12,24.97 arc-72 26.7,24.54 v26.92,23.85
  Bottom 0.305: v36.42,22.28 40.46,22.28 43.56,19.48 44.37,18.97 44.42,18.92 arc18 IO.6
AUX2  (via drill 0.41)
  Top 0.254: v23.16,27.36 21.77,25.32 20.17,24.82 19.81,24.71 19.05,24.71 18.82,24.74 IC1.46
  Bottom 0.254: v23.16,27.36 24.23,27.36 29.13,32.31 | 40.62,34.8 41.05,34.8
  Bottom 0.305: 29.13,32.31 32.77,33.02 38.27,33.07 arc44 39.37,33.53 39.37,33.78 39.62,34.04 39.62,34.29 39.86,34.51 arc-42 40.62,34.8 | 41.05,34.8 arc-46 41.73,34.51 48.62,28.07 48.59,22.68 arc-45 48.12,21.75 47.9,21.39 48.28,21.51 IO.7
CLOCK  (via drill 0.41)
  Top 0.203: 29.82,17.68 29.64,18.11 29.64,18.57 29.89,17.66
  Top 0.254: v28.93,23.62 28.88,24.21 30.4,24.21 IC1.2 | v21.59,19.53 21.49,20.27 21.36,20.65 21.36,21.64 IC1.50 | 29.41,18.29 29.46,18.16 29.89,17.66 29.72,18.69 v29.67,18.64 | 44.78,13.36 IO.2 44.76,13.23 44.76,9.3 42.04,7.59 42.04,1.27 40.06,1.27 37.26,3.05 AVRICSP.3 37.16,3.1 36.6,3.1 36.6,3.2 35.99,4.45 33.88,4.45 31.29,6.99 31.29,11.38 31.37,11.81 v31.37,13.21 | 29.82,17.68 29.57,16.1 29.62,16.05 RN1.1
  Bottom 0.203: 30.23,17.78 30.1,19.94 29.99,19.97 | 21.59,19.41 v21.59,19.53
  Bottom 0.254: v29.67,18.64 29.99,19.97 30.18,20.75 30.73,22.07 30.1,22.86 v28.93,23.62 | 28.54,15.07 26.98,15.04 | 28.54,15.07 30.23,17.78 | v31.37,13.21 30.4,13.21 28.54,15.07
  Bottom 0.305: v29.67,18.64 29.67,17.93 29.72,17.93 | 26.98,15.04 21.59,19.41
CS  (via drill 0.41)
  Top 0.203: v27.61,17.5 27.69,17.37
  Top 0.254: v22.5,20.17 22.35,20.98 22.35,21.64 IC1.52 | v27.61,17.5 27.1,17.3 26.84,17.2 26.72,17.09 26.06,16.94 26.06,10.54 32.97,3.89 32.97,1.91 33.6,1.27 v38.23,1.27 | 44.73,15.92 IO.4 44.17,15.36 43.92,14.71 43.61,14.15 43.61,13.97 41.99,11.94 41.99,11.79 42.04,11.73 v42.04,11.84 | 27.69,17.37 27.94,16.31 27.94,16.05 RN1.3 | v41.33,9.93 41.27,9.73 41.27,4.83 39.8,3.1 39.8,3.07 AVRICSP.5
  Bottom 0.254: 25.09,19.3 24.13,19.81 v22.5,20.17 | v38.23,1.27 39.78,3.07 AVRICSP.5 | v42.04,11.84 42.04,10.64 v41.33,9.93
  Bottom 0.305: v27.61,17.5 27.28,17.75 25.09,19.3
EE_SCL
  Top 0.254: IC3.1 5.16,20.22 arc-38 6.44,20.69 6.71,20.7 7.11,20.88 R9.1 7.16,20.78 6.96,20.78 7.59,19.89 14.22,19.86 arc37 15,20.13 16.43,21.23 arc52 16.74,21.84 16.76,23.91 arc-27 16.88,24.37 17.36,25.31 arc-61 18.05,25.72 18.54,25.73 18.77,25.7 IC1.44
EE_SDA
  Top 0.254: IC3.3 R8.1 6.88,23.93 6.68,23.57 7.14,24.46 9.58,24.51 9.58,21.56 arc37 9.68,21.25 10.01,20.8 arc53 10.4,20.47 14.2,20.47 arc35 14.48,20.69 15.74,21.57 arc56 16.2,22.46 16.18,23.75 arc-30 16.37,24.46 16.9,25.7 arc-57 17.69,26.16 18.29,26.24 18.77,26.21 IC1.43
EE_WP
  Top 0.254: IC3.5 1.67,19.76 arc90 2.36,19.08 3.94,19.1 14.4,19.1 arc34 15.1,19.31 16.86,20.52 arc56 17.32,21.38 17.32,23.62 arc-24 17.48,24.36 17.72,24.99 arc-68 18.25,25.21 18.77,25.2 IC1.45
EXVUSB
  pour Top (isolate 0.305, no thermals): 7.72,34.67 8.99,34.67 8.99,37.22 7.72,37.22 7.72,39.76 9.24,39.76 9.72,39.28 11.78,39.28 11.78,33.56 11.05,32.83 7.72,32.83
GND  (via drill 0.41, 0.41 pad 0.61)
  Top 0.254: C8.2 USB.GND 6.22,29.9 5.92,30.3 arc53 5.05,30.73 v2.54,30.73 | C8.2 C7.2 | 16.64,42.93 16.66,42.8 C14.- R12.1 C4.2 | 26.02,43 25.93,42.93 26.87,42.93 VR2.2 v29.34,42.93 29.46,42.8 29.46,41.24 arc45 29.62,40.87 arc45 30.17,40.64 32.15,40.64 arc45 32.33,40.72 arc45 32.73,41.69 C11.2 34.31,43.07 34.65,43.41 v34.65,44.04 | 26.02,43 25.78,44.45 | 25.78,48 LED4.C | IC1.9 33,27.71 27.93,27.71 arc72 27.39,27.19 v27.18,26.54 | IC1.25 24.38,34.92 24.25,35.45 arc-59 24.49,36.3 25.15,36.96 v25.53,38.1 26.42,37.28 arc-56 26.92,35.85 26.8,35.05 IC1.20 | C1.2 v25.65,40.01 24.38,39.88 C4.2 | C4.2 C13.2 26.02,43 | v21.84,27.56 21.39,27.29 arc-32 20.99,27.18 IC1.41 17.95,27.2 arc42 16.6,26.55 v16.51,26.47 | C8.2 v11.05,26.24 11.06,26.21 arc90 10.08,25.23 10.08,22.29 arc66 10.26,22.02 10.65,21.84 arc-63 10.94,21.42 v10.95,21.23 | v2.92,21.21 IC3.2 | JP1.2 5.58,41.98 arc90 6,41.9 C12.2 | C5.2 C9.2 v12.37,32.46 | C6.2 1.52,24.15 v1.14,23.5 | v37.74,46.89 37.72,46.99 37.47,47.5 36.96,48 LED2A.C 36.58,47.47 36.58,46.74 36.2,46.35 v35.69,46.35 | v41.66,45.97 42.67,46.61 45.34,46.61 46.23,47.37 LED3A.C | 40.74,17.53 IC2.7 | 12.47,14.78 10.46,16.15 NORMAL.1
  Top 0.305: VR3.2 16.64,42.93 LED1.C | 25.78,44.45 25.78,48 | v41.1,28.12 C2.2 | RN2.3 RN2.2 v41.02,32.13 | v39.83,20.93 C10.2 41.11,23.24 arc60 42.42,25.08 arc91 40.78,25.39 RN3.2 RN3.3 v40.64,26.16 | 33,27.71 v34.04,28.07 | v40.74,17.6 40.74,17.53 | v15.75,42.8 16.66,42.8 | C12.2 v7.52,42.04
  Top 0.356: v11.96,43.03 VR1.2
  Bottom 0.254: v25.65,40.01 v25.53,38.1 | v21.84,27.56 22.07,26.7 arc75 23.43,25.65 | v16.51,26.47 14.81,26.47 14.48,26.21 v11.05,26.24 10.73,26.87 10.72,30.14 arc-52 v12.37,32.46 | v12.97,14.62 9.2,14.58 9.15,18.05 v10.95,21.23 10.23,21.25 5.08,21.21 v2.92,21.21 2.92,23.5 v1.14,23.5 | v37.74,46.89 v41.66,45.97 | v34.65,44.04 34.67,46.1 34.92,46.35 v35.69,46.35 | 26.92,25.76 33.27,25.65
  Bottom 0.305: v34.04,28.07 v41.1,28.12 | v41.1,28.12 42.42,28.83 42.93,28.5 42.93,27.61 43.95,26.58 IO.12 | v41.1,28.12 v41.02,32.13 | 23.43,25.65 26.92,25.76 v27.18,26.54 | v39.83,20.93 v40.74,17.6 | v41.1,28.12 41.02,27.18 40.64,26.8 v40.64,26.16 | 33.27,25.65 v34.04,25.53 | v15.75,42.8 v11.96,43.03 8.89,41.53 7.82,42.09 7.65,42.33 v7.52,42.04
  Bottom 0.406: JP1.2 5.57,40.08 5.59,38.23
  other vias: 19.94,42.93
  pour Top (isolate 0.305, rank 2, hatched): 0.17,49.98 49.97,49.97 49.9,0.06 0.06,-0.05
  pour Bottom (isolate 0.305, rank 2, hatched): 0.17,49.95 49.91,49.98 arc-4 49.88,0.15 0.04,-0.03
  pour Bottom: 8.64,45.72 32.64,45.72 32.64,40.39 8.64,40.39
LD1  (via drill 0.41)
  Top 0.254: v27.46,47.35 28.19,47.95 29.11,47.95 R5.2 | v24.74,31.24 25.91,31.24 26.34,31.7 26.34,33.73 IC1.21
  Bottom 0.254: 27.46,43.56 27.48,45.34 | 27.66,39.68 arc-42 27.5,40.09 | 31.47,36.09 arc-89 30.76,34.86 29.64,34.85 29.15,34.85 arc41 28.64,34.66
  Bottom 0.305: 27.48,45.34 v27.46,47.35 | 31.47,36.09 27.66,39.68 | 27.5,40.09 27.46,43.56 | v24.74,31.24 28.64,34.66
MCLR  (via drill 0.41)
  Top 0.254: v31.19,20.9 32.05,23.55 32.41,23.63 arc82 32.92,25.09 31.41,26.71 30.47,26.74 30.52,26.71 IC1.7 | R7.1 8.84,8.46 9.02,8.28 10.03,6.6 10.85,4.78 10.85,3.76 ICSP.1 | v17.65,9.04 20.19,9.04 20.19,11.4 RESET.1 20.93,12.8 v21.21,11.51
  Bottom 0.254: v31.19,20.9 31.6,20.52 37.49,13.62 36.25,11.61 35.76,10.11 35.76,10.03 35.61,9.37 35.61,9.2 35,8.59 33.63,8.08 31.06,6.27 30.23,6.53 29.52,6.58 29.21,6.58 27.25,6.66 22.15,10.74 v21.21,11.51 | 11.02,4.95 11.02,3.91 10.87,3.76 ICSP.1
  Bottom 0.305: 11.02,4.95 v17.65,9.04
MISO  (via drill 0.41)
  Top 0.203: 25.6,17.65 25.31,16.02
  Top 0.254: v29.74,21.87 30,23.01 30,23.67 30.4,23.67 IC1.1 | v22,23.39 21.84,22.48 21.84,21.69 21.87,21.69 IC1.51 | 43.63,17.61 arc45 44.45,17.27 45.16,17.27 arc-45 46.26,16.82 IO.3 | v28.85,17.37 28.85,16.15 28.75,16.05 RN1.2 | 25.6,17.65 25.25,15.98 25.25,6.04 27.69,4.12 UARTHDR.2
  Top 0.305: 25.48,17.45 25.31,16.02 25.4,17.53 v27.99,19.23 | v36.12,19.2 41.27,19.2 arc-45 43.43,19.26 arc-45 43.43,19.24 43.43,18.08 arc45 43.63,17.61
  Bottom 0.254: v22,23.39 22.58,22.33 23.19,22.35 27.61,22.35 28.47,21.49 v29.74,21.87 28.17,22.66 28.17,23.98 arc-90 28.77,24.59 29.34,24.59 31.24,22.68 31.52,22.66 32.05,22 32.13,21.72 | UARTHDR.2 29.34,1.96 30.73,1.96 30.94,2.16 31.24,2.16 32.16,3.07 34.7,3.07 AVRICSP.1
  Bottom 0.305: 28.35,18.34 28.47,21.49 | 28.35,18.34 v28.85,17.37 | v27.99,19.23 28.35,18.34 | 32.13,21.72 34.42,19.81 35.51,19.81 v36.12,19.2
MOSI  (via drill 0.41)
  Top 0.254: v33.66,22.66 33.05,22.25 33.02,21.49 R10.1 | v31.96,24.35 31.69,24.62 31.32,24.71 30.61,24.71 IC1.3 27.36,24.79 26.76,24.79 arc78 25.89,24.08 v25.83,23.82 | v24.23,24.08 23.71,24.34 arc37 22.84,24.48 21.97,24.26 21.59,24.13 21.08,23.75 20.91,23.32 20.78,23.06 20.52,22.12 IC1.49 20.85,21.59
  Bottom 0.254: v31.96,24.35 33.07,23.29 33.63,22.66 v33.66,22.66 | v25.83,23.82 v24.23,24.08 | 37.59,19.56 39.37,15.75 42.42,16.43 43.18,15.67 43.16,11.84 43.54,11.46 43.74,11.46 | IO.1 47.9,13.03 47.83,11.46 44.53,11.46 | 43.74,11.46 44.53,11.46 | 44.53,11.46 44.53,11.33 | 43.74,11.46 43.23,11.33 40.87,7.59 39.7,7.34 39.65,7.29 39.24,7.29 39.14,7.19 39.04,7.19 38.91,7.06 38.79,7.06 37.34,5.61 37.26,5.61 AVRICSP.4 37.16,5.64 37.13,5.61 35.92,6.58 34.14,7.19 33.45,6.93 33.07,6.58 30.5,3.86 UARTHDR.3
  Bottom 0.305: 37.59,19.56 v33.66,22.66
MS0
  Top 0.254: 13.87,17.96 14.61,17.92 arc46 15.98,18.52 17.8,20.44 arc28 17.91,20.63 18.77,23.67 IC1.48
  Top 0.406: 13.87,17.96 4.28,18 arc90 3.35,16.56 NORMAL.P$2
N$1
  Top 0.254: 33.6,19.25 33.25,19.13 32.61,16.97 33.17,15.95 33.93,15.95 IC2.9
  Top 0.305: 33.6,19.25 34.65,20.42 34.7,21.44 R10.2
N$2  (via drill 0.41)
  Top 0.254: IC2.11 33.93,14.63 32.38,14.86 32.31,14.99 v32.31,15.49 | v30.89,14.25 30.63,14.07 29.64,14.07 RN1.8
  Bottom 0.254: v30.89,14.25 31.88,15.24 v32.31,15.49
N$3
  Top 0.254: Q1.3 38.33,39.24 38.46,39.06 39.7,38.33 D1.A
N$4  (via drill 0.41)
  Top 0.254: IC2.2 39.78,13.31 39.32,13.36 38.71,13.36 38.84,13.18 37.69,13.18 35.43,11.43 32.41,11.43 v32.41,11.28 | v27.99,11.66 28.04,11.86 28.04,13.31 27.94,13.46 27.94,14.07 RN1.6
  Bottom 0.254: v32.41,11.28 29.16,11.28 28.78,11.66 28.3,11.68 28.02,11.68 v27.99,11.66
N$5  (via drill 0.41)
  Top 0.254: 36.17,13.34 35.56,12.22 | 36.17,13.34 37.36,14.02 39.32,14.02 39.78,13.97 IC2.3 | v30.33,10.31 29.57,11.05 29.01,13.39 28.75,13.82 28.75,14.07 RN1.7 | v35.69,13.31 36.17,13.34
  Bottom 0.254: v30.33,10.31 33.5,10.57 35.74,13.31 v35.69,13.31
N$6  (via drill 0.41)
  Top 0.254: R5.1 30.89,48.01 v32.41,48.03 33.93,48.01 LED2A.A
  Bottom 0.254: v32.41,48.03 33.93,48.01 LED2A.A
N$7  (via drill 0.41)
  Top 0.254: R3.1 10.87,48.01 v12.46,48.03 13.92,48.01 LED1.A
  Bottom 0.254: v12.46,48.03 13.92,48.01 LED1A.A
N$8
  Top 0.254: R2.1 43.41,43.16 41.22,43.16 R14.2 41.17,43.1 41.07,43 39.09,43 38.94,42.85 Q2.1
N$9
  Top 0.254: C7.1 11.53,23.57 11.68,23.72 14.48,23.72 14.53,23.77 X1.2 14.28,23.77 15.19,25.7 15.25,26.24 arc-45 15.76,27.15 arc-36 17.13,27.67 18.77,27.74 IC1.40
N$10
  Top 0.203: IC1.56 24.36,21.77 | 22.23,18.72 22.48,19.13 23.11,19.76 23.47,19.76 24.16,20.45 24.26,20.52
  Top 0.254: 24.26,20.52 24.36,20.62 IC1.56 | 22.23,18.72 20.73,16.97 19.48,16.97 20.24,16.59 C15.+
N$11
  Top 0.254: R15.2 16.46,36.22 17.66,36.24 arc-45 18.39,35.95 18.75,35.61 19.1,35.25 arc-34 19.85,33.87 20.07,32.77 20.17,32.56 20.17,30.73 18.82,30.73 IC1.34
N$12
  Top 0.254: C8.1 11.53,28.91 14.53,28.91 X1.1 14.2,28.85 15.37,28.6 15.8,28.43 arc22 17.01,28.19 18.77,28.19 IC1.39
N$13  (via drill 0.41)
  Top 0.254: R4.1 20.88,48.01 v22.43,48.01 23.93,48.01 LED4.A
  Bottom 0.254: v22.43,48.01 23.93,48.01 LED4A.A
N$14
  Top 0.254: D2.A 39.55,41.27 39.4,41.17 37.82,41.17 37.14,42.11 arc-45 36.65,43.28 36.65,43.76 Q2.3
N$15
  Top 0.254: D3.A 4.78,39.12 4.42,38.76 4.39,39.4
  Top 0.305: JP1.1 3.03,39.22
  Top 0.406: 3.03,39.22 arc89 4.39,39.4
N$16  (via drill 0.41)
  Top 0.254: v35.38,7.64 34.72,5.61 AVRICSP.2
  Bottom 0.254: v35.38,7.64 AVRVCC.2
N$17
  Top 0.254: R13.2 32.97,37.44 33.33,37.8 33.33,39.37 33.38,39.37 R1.1 33.48,39.37 arc-45 34.75,39.82 35,40.18 Q1.1
N$18  (via drill 0.41)
  Top 0.254: R6.1 40.89,48.01 v42.39,48.01 LED3A.A
  Bottom 0.254: v42.39,48.01 LED3A.A
PGC  (via drill 0.41)
  Top 0.203: 24.41,17.2 24.23,18.03 24.61,18.03 24.11,18.52 24.18,18.59 v24.26,18.69
  Top 0.254: v29.54,33.3 29.16,33.33 | v26.36,19.66 24.59,18.95 v24.26,18.69 | 28.5,33.6 IC1.17 | 24.41,17.2 24.16,16.82 24.49,14.96 24.49,7.47 ICSP.5
  Top 0.406: 29.16,33.33 28.5,33.6
  Bottom 0.254: v29.54,33.3 28.88,32.92 23.98,28.4 21.63,28.51 arc24 21.25,28.45 21.18,28.43 arc36 20.54,27.91 20.47,27.8 arc33 20.3,27.21 20.3,25.6 20.34,25.17 20.98,23.14 21.97,21.34 v26.36,19.66
  Bottom 0.305: v24.26,18.69 24.64,18.69
PGD  (via drill 0.41)
  Top 0.254: v27.79,35.61 27.86,34.04 IC1.18
  Bottom 0.254: 26.42,34.24 v27.79,35.61 | 22.07,34.14 21.97,34.16 18.03,34.16 18.01,34.01 17.02,34.01 13.89,37.01 13.28,37.06 12.34,36.12 12.45,35.79 17.91,30.33 17.91,30.23 18.03,20.02 18.11,18.59 | 19.3,16.89 19.35,16.55 19.25,16.43 19.38,15.29 19.38,12.29 18.8,7.64 18.47,4.42 18.47,3.76 ICSP.4
  Bottom 0.305: 22.07,34.14 26.42,34.24 | 19.35,16.55 18.11,18.59
PULLUPEN  (via drill 0.41)
  Top 0.203: 27.15,15.34 27.76,14.99 30.43,14.99 31.24,15.24 | 31.19,18.24 30.96,18.47 30.89,18.54
  Top 0.254: IC2.13 33.98,13.36 33.98,13.97 IC2.12 | IC2.6 39.83,15.9 39.83,15.34 IC2.5 39.78,15.44 36.78,15.44 35.05,14.22 34.8,13.97 34.37,13.97 34.04,14.02 IC2.12 | 30.89,18.54 arc65 30.5,19.16 28.98,19.86 28.55,20.42 28.4,21.06 28.45,21.51 IC1.64 | IC2.12 33.88,13.97 33.66,13.99 v32.46,13.87 32.31,13.92 32.18,13.92 31.75,14.61 31.24,15.24 | 27.15,15.34 27.15,15.67 27.05,16.03 RN1.4 | 30.43,14.99 31.19,18.24
PUVSEL33  (via drill 0.41)
  Top 0.203: 21.31,32.33 IC1.31
  Top 0.254: v44.45,44.91 43.41,44.88 R2.2 | v22.43,31.45 21.57,31.8 21.31,32.33
  Bottom 0.254: 34.9,36.76 arc-45 34.66,36.19 33.7,34.21 arc45 33.68,34.16 29.33,34.16 arc45 28.91,33.99 26.62,31.7 26.62,31.55 24.66,29.97 v22.43,31.45 | 34.9,41.72 arc-135 34.9,41.73 | 39.9,44.66 arc-38 40.6,44.91
  Bottom 0.305: 34.9,36.76 34.9,41.72 | 34.9,41.73 39.9,44.66 | 40.6,44.91 v44.45,44.91
PUVSEL50  (via drill 0.41)
  Top 0.254: v27.91,37.08 28.75,37.59 29.5,38.34 arc-45 31.5,39.17 R1.2 | v24.36,38 23.24,36.96 22.4,36.55 21.68,36.44 arc85 20.81,35.35 20.85,34.62 20.85,33.91 IC1.32
  Bottom 0.254: v27.91,37.08 25.4,37.08 v24.36,38
SWV33  (via drill 0.41)
  Top 0.203: v44.6,32.99 44.58,32.99 44.42,33.12
  Top 0.254: 39.17,47.95 R6.2 39.17,47.9 39.14,44.78 Q2.2 | VR2.5 30.73,43.84 32.66,43.84 32.72,43.79 C11.1 32.77,43.84 32.92,43.99 34.04,44.98 arc-45 35.92,45.19 37.77,45.19 38.23,44.73 38.84,44.73 Q2.2 | Q2.2 38.94,44.73 41.07,44.73 41.17,44.83 R14.1 41.17,44.93 42.95,45.7 45.29,45.7 | AVRVCC.1 36.6,11.46 40.89,11.46 40.89,11.4 42.72,10.08 v43.76,10.08
  Top 0.305: 42.57,27.13 RN3.4 | 42.57,27.13 43.6,24.56 arc72 43.66,24.51 IO.10 | 44.87,33.71 arc38 45.29,34.92 | 42.42,27.74 42.57,27.13 | 42.42,27.74 42.29,27.74 | 42.42,27.74 42.67,27.74 42.67,30.37 arc-38 42.96,31.2
  Top 0.406: 45.29,34.92 45.29,45.7 | 42.96,31.2 44.42,33.12 44.87,33.71
  Bottom 0.203: 47.68,29.95 47.65,29.92 47.52,29.92 | 44.53,32.92 v44.6,32.99
  Bottom 0.254: v43.76,10.08 48.08,10.08 49.2,11.38 49.2,28.19 47.68,29.95 | 47.52,29.92 44.53,32.92
SWV50  (via drill 0.41)
  Top 0.203: v19.38,19.86 19.36,19.89 19.25,20.07
  Top 0.254: C13.1 23.82,43.79 23.67,43.94 v22.58,43.94 21.39,43.94 VR3.5 | 38.08,34.78 36.98,34.8 35.79,34.85 arc-45 35.8,36.28 35.89,37.26 35.69,37.29 Q1.2 34.92,37.97 34.54,37.08 33.35,35.79 32.97,35.76 R13.1 32.87,35.76 30.94,35.76 v30.12,35.81 30.4,33.56 arc-61 29.84,32.25 27.94,30.86 v27.28,29.13 | 19.91,22.28 19.94,22.66 20.57,24.13 24.03,25.98 v24.38,26.62 | AVRVCC.3 37.64,8.28 36.22,8.28 35.53,8.51 v32.26,8.51
  Top 0.305: 38.08,34.78 arc-66 39.47,33.66 39.57,33.83 RN2.4 39.67,33.78 40.64,33.78 v40.95,33.73
  Top 0.406: 19.25,20.07 arc39 19.74,21 19.91,22.28
  Bottom 0.203: v19.38,19.86 19.36,19.84
  Bottom 0.254: v30.12,35.81 27,39.41 arc-41 26.8,39.96 26.8,41.29 arc63 26.38,41.97 24.76,42.77 arc25 24.34,42.88 23.83,42.89 arc-56 22.96,43.37 v22.58,43.94 | v24.38,26.62 v27.28,29.13 | v32.26,8.51 29.74,8.51 28.78,10.24 28.57,10.29 24.21,10.29 22.33,11.91
  Bottom 0.305: v40.95,33.73 47.22,27.99 47.22,27.08 IO.11
  Bottom 0.406: 22.33,11.91 20.07,18.8 v19.38,19.86
USB_D+  (via drill 0.41)
  Top 0.254: v12.62,31.09 10.46,31.5 8.38,31.5 USB.D+ | IC1.37 18.77,29.21 18.29,29.23 16.57,29.23 arc-90 15.77,30.03 15.77,30.2 arc45 v15.5,30.43
  Bottom 0.254: v12.62,31.09 13.51,30.88 arc-10 14.1,30.77 v15.5,30.43
USB_D-  (via drill 0.41)
  Top 0.254: v16.79,30.02 17.4,29.72 IC1.36 | USB.D- 8.38,32.31 9.89,32.31 arc45 12.38,33.62 12.36,33.47 arc45 v12.7,33.53 12.45,33.66
  Bottom 0.254: v16.79,30.02 16.38,30.79 v12.7,33.53
USBID
  Top 0.254: USB.ID 11.15,30.51 arc45 13.32,30.36 13.67,30.6 arc-38 14.99,31.32 17.25,31.23 17.83,31.24 18.78,31.24 IC1.33
USBLED  (via drill 0.41)
  Top 0.254: 19.1,47.95 R4.2 19.15,47.9 v18.52,45.16 | v25.07,35.56 25.22,34.9 25.35,34.16 25.38,33.91 IC1.23
  Bottom 0.254: v25.07,35.56 18.88,40.55 arc-51 18.52,41.31 v18.52,45.16
VEXTERN
  Top 0.203: 38.56,28.65 38.56,30.23
  Top 0.254: 43.61,38.33 43.56,38.33 D1.C 43.51,38.38 43.41,38.38 43.41,41.22 D2.C | 41.5,14.68 41.5,12.8 41.35,12.65 40.41,12.65 39.83,12.7 IC2.1 | 41.5,14.68 39.65,14.68 39.83,14.63 IC2.4 | IC2.10 34.01,15.29 34.39,15.24 34.75,15.24 34.9,15.52 34.9,16.23 34.7,16.61 IC2.8 33.98,16.66 34.09,16.66 34.09,17.66 | 41.5,14.68 41.5,17.79
  Top 0.305: 43.61,38.33 43.64,34.36 arc-39 43.43,33.78 42.33,32.01 arc-27 41.9,31.59 41.59,31.41 arc-31 41.18,31.29 39.67,31.29 39.62,31.24 RN2.1 39.57,31.14 38.56,30.23 | 34.67,19.07 37.64,22.05 | 37.64,22.05 38.1,22.5 C10.1 38.15,22.55 38.12,22.53 38.15,27.86 38.56,28.65 | 34.67,19.07 arc45 34.09,17.66 | 41.5,17.79 arc90 40.88,18.41 35.95,18.41 arc-45 34.89,18.86 34.67,19.07 | IO.9 46.59,22.59 arc-54 46.11,22.34 45.13,22.35 arc56 43.71,21.61 arc-57 41.46,20.09 38.46,20.14 37.74,22 37.69,22 37.64,22.05
VREGEN  (via drill 0.41)
  Top 0.254: 25.91,35.46 v25.91,36.32 | 25.91,35.46 25.91,35.33 | 25.91,35.46 25.88,34.8 25.88,34.04 IC1.22 | VR3.3 18.75,41.96 18.9,41.81 19.15,41.86 19.18,41.3 arc47 19.93,40.97 21.46,40.97 v21.49,41 | v24.51,40.84 26.48,41.74 arc-25 26.77,41.81 27.94,41.81 28.09,41.96 VR2.3
  Bottom 0.254: v25.91,36.32 25.02,36.32 22.07,39.04 | 22.07,39.04 v24.51,40.84 | 22.07,39.04 21.72,39.04 21.46,39.29 21.46,40.89 v21.49,41
VUSB  (via drill 0.41)
  Top 0.254: IC2.14 33.93,12.7 33.6,12.65 33.12,12.65 32.97,12.9 32.89,12.83 v32.84,12.57 | 12.65,43.94 12.95,43.89 13.06,43.79 | v15.47,43.99 15.85,43.95 | v13.48,36.08 13.72,35.95 | 12.8,41.99 12.93,41.94 VR1.1 | R11.1 L1.1 | v27.03,12.85 27,12.88 27,13.31 27.05,13.36 27.05,14.07 RN1.5 | v23.52,12.5 C3.1
  Top 0.305: 12.65,43.94 14.22,43.81 v15.47,43.99 | v17.4,44.53 VR3.1 20.83,45.21 24.51,45.21 25.02,44.96 v25.07,43.59 | VR1.1 C14.+ R11.1 R15.1 v13.48,36.08 | v26.72,44.32 VR2.1
  Bottom 0.203: 21.34,18.57 21.29,18.57 21.01,18.85 20.85,19.07
  Bottom 0.254: v25.07,43.59 v26.72,44.32 | 19.79,30.4 17.7,31.55 | v32.84,12.57 32.44,12.57 31.6,11.99 29.87,11.99 28.65,12.7 v27.03,12.85 | v23.52,12.5 25.12,12.5 26.95,12.8 v27.03,12.85 | v27.03,12.85 26.98,12.93
  Bottom 0.305: 20.85,19.07 19.84,21.29 19.74,23.62 19.79,30.4 | 17.7,31.55 v13.48,36.08 | 26.98,12.93 21.34,18.57
  Bottom 0.406: v15.47,43.99 v17.4,44.53
  pour Top (no thermals): 12.67,46.87 28.61,46.87 28.61,43.56 14.64,43.44 14.64,35.95 13.05,35.95 12.92,41.69 12.67,42.58

### Text on the board
tPlace: USB | PWR | MODE | VREG | AUX | ADC | 3V3 | GND | PGD | PGC | MCLR | Jan 2012
tNames: AUX1 | CS
bNames: BPv4.0c
tValues: vimark | v.trocio
Reference: EXT PWR | USB-OTG | V+ - GND | I/O header | GND | +5v | +3v | Vpu | USB | ADC | AUX2 | AUX1 | AUX | CS | MISO | CLK | MOSI | MCLR | +3.3V | GND | DATA | CLOCK | BUS PIRATE V4.0c -clone w breakouts | CC-0 | Programming Header | http://dangerousprototypes.com
_tsilk: --GND-- | GND | VEXT | 5V | 3.3 | GND | RX | TX | UART
_bsilk: Order#8054 | GND | +5V | +3.3 | Vpu | ADC | AUX2 | AUX1 | AUX | CS | MISO | CLK | MOSI
200bmp: D:/My Pictures/Art Projects/bp-chest.bmp | D:/My Pictures/Art Projects/bp-jollyrodger-cropped.bmp | D:/My Pictures/Art Projects/bp-jollyrodger.bmp
203bmp: RESET | RESET | RESET | RESET | D:/My Pictures/Art Projects/bp-jollyrodger-cropped.bmp | D:/My Pictures/Art Projects/bp-ship.bmp | D:/My Pictures/Art Projects/bp-ship.bmp | D:/My Pictures/Art Projects/bp-ship.bmp